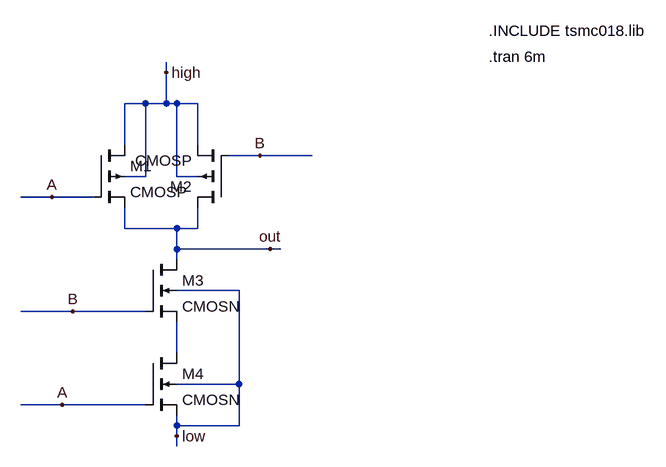
[diagram p0: schematic nand_gate.asc]
nand_gate.asc, the LTspice schematic file:
Version 4
SHEET 1 964 680
WIRE 208 -48 208 -64
WIRE 176 0 144 0
WIRE 208 0 208 -48
WIRE 208 0 176 0
WIRE 224 0 208 0
WIRE 256 0 224 0
WIRE 144 64 144 0
WIRE 256 64 256 0
WIRE 352 80 304 80
WIRE 432 80 352 80
WIRE 176 112 176 0
WIRE 176 112 144 112
WIRE 224 112 224 0
WIRE 256 112 224 112
WIRE 32 144 -16 144
WIRE 96 144 32 144
WIRE 144 192 144 160
WIRE 224 192 144 192
WIRE 256 192 256 160
WIRE 256 192 224 192
WIRE 224 224 224 192
WIRE 368 224 224 224
WIRE 384 224 368 224
WIRE 224 240 224 224
WIRE 320 288 224 288
WIRE 64 320 -16 320
WIRE 176 320 64 320
WIRE 224 384 224 336
WIRE 320 432 320 288
WIRE 320 432 224 432
WIRE 48 464 -16 464
WIRE 176 464 48 464
WIRE 224 496 224 480
WIRE 320 496 320 432
WIRE 320 496 224 496
WIRE 224 512 224 496
WIRE 224 528 224 512
FLAG 48 464 A
FLAG 32 144 A
FLAG 352 80 B
FLAG 64 320 B
FLAG 224 512 low
FLAG 208 -48 high
FLAG 368 224 out
SYMBOL cmosp 96 64 R0
SYMATTR InstName M1
SYMBOL cmosp 304 160 R180
SYMATTR InstName M2
SYMBOL cmosn 176 240 R0
SYMATTR InstName M3
SYMBOL cmosn 176 384 R0
SYMATTR InstName M4
TEXT 704 -112 Left 2 !.INCLUDE tsmc018.lib
TEXT 704 -72 Left 2 !.tran 6m

The netlist it stands for:
* nand_gate.asc
M1 high A out high CMOSP
M2 out B high high CMOSP
M3 out B N001 low CMOSN
M4 N001 A low low CMOSN
.model NMOS NMOS
.model PMOS PMOS
.lib standard.mos
.INCLUDE tsmc018.lib
.tran 6m
.backanno
.end